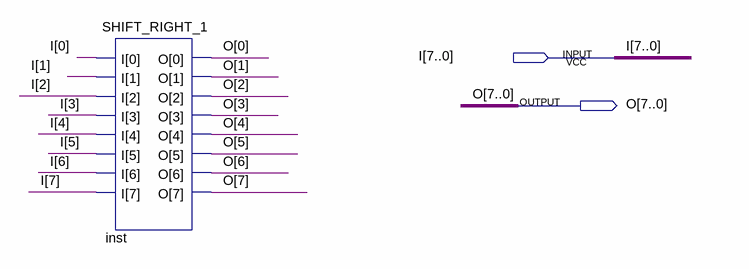
[diagram p0: schematic sheet]
// Quartus schematic shift_R_1.bdf as structural Verilog: 1 symbols, 2 pins
module shift_R_1 (
  input  [7:0] I,
  output [7:0] O
);

  SHIFT_RIGHT_1 inst (.I(I), .O(O));
endmodule
